# Altium schematic sheet Switches.SchDoc: Shaheen PCB Board
size A3; Author: Mattia Sinigaglia; CompanyName: University of Bologna; DrawnBy: Mattia Sinigaglia; Organization: EES - Micrel Lab; Revision: v1; SheetNumber: 5; SheetTotal: 6
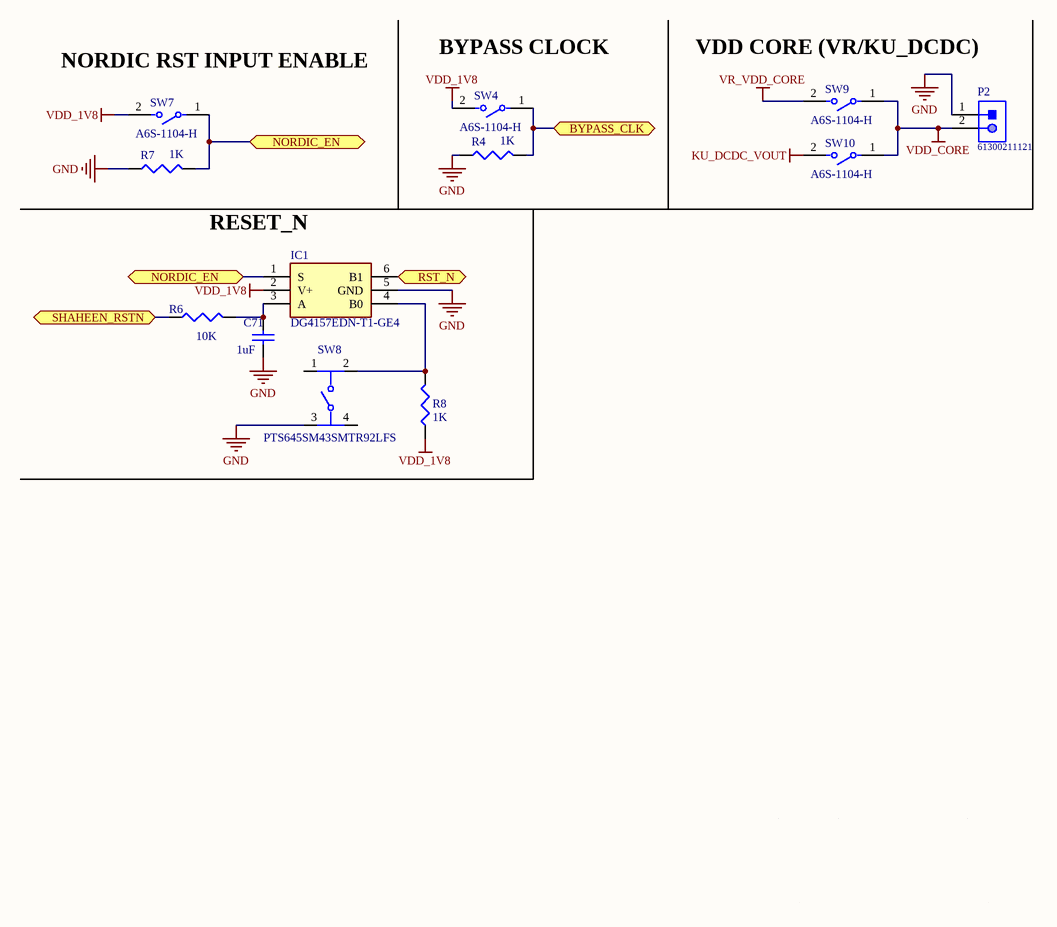
[diagram p0: Switches.SchDoc]

## Parts
C71  value 1uF  [0603]  (hidden comment: Cap)
IC1  DG4157EDN-T1-GE4  [SON35P100X100X38-6N]
P2  61300211121  [61300211121]
R4  value 1K  [J1-0603]  (hidden comment: 0R)
R6  value 10K  [J1-0603]  (hidden comment: 0R)
R7  value 1K  [J1-0603]  (hidden comment: 0R)
R8  value 1K  [J1-0603]  (hidden comment: 0R)
SW4  A6S-1104-H  [FP-A6S-1104-H-MFG]
SW7  A6S-1104-H  [FP-A6S-1104-H-MFG]
SW8  PTS645SM43SMTR92LFS  [FP-PTS645SM43SMTR92LFS-MFG]
SW9  A6S-1104-H  [FP-A6S-1104-H-MFG]
SW10  A6S-1104-H  [FP-A6S-1104-H-MFG]

## Ports
BYPASS_CLK (bidir), NORDIC_EN (bidir), RST_N (bidir), SHAHEEN_RSTN (bidir)

## Nets
GND: C71.2 IC1.5(GND) P2.1 R4.2 R7.2 SW8.3
KU_DCDC_VOUT: SW10.2
VDD_1V8: IC1.2(V+) R8.2 SW4.2 SW7.2
VDD_CORE: P2.2 SW9.1 SW10.1
VR_VDD_CORE: SW9.2
BYPASS_CLK: R4.1 SW4.1 ; port BYPASS_CLK
NORDIC_EN: IC1.1(S) R7.1 SW7.1 ; port NORDIC_EN
RST_N: IC1.6(B1) ; port RST_N
SHAHEEN_RSTN: R6.2 ; port SHAHEEN_RSTN
NetC71_1: C71.1 IC1.3(A) R6.1
NetIC1_4: IC1.4(B0) R8.1 SW8.2

Not connected (* = marked no-connect by the designer): SW8 1 4

## Notes on the sheet
- (near SW7) NORDIC RST INPUT ENABLE
- (near SW4) BYPASS CLOCK
- (near SW9) VDD CORE (VR/KU_DCDC)
- RESET_N
- 1
- 2
- 3
- 4
- 5
- 6
- 7
- 8
- A
- B
- C
- D
- Project:
- Date:
- Drawing number:
- Rev:
- Format:
- A3
- Drawn by:
- Laboratory:
- Page
- Sheet:
- of
- File:

## Library data of the parts
C71 = Cap: Capacitor; Published: 8-Jun-2000; LatestRevisionDate: 17-Jul-2002; LatestRevisionNote: Re-released for DXP Platform.; PackageReference: RAD-0.3; Publisher: Altium Limited; PackageDescription: Radial Cap, Thru-Hole; 2 Leads; 0.3 in Pin Spacing
IC1 = DG4157EDN-T1-GE4: Integrated Circuit; Manufacturer_Name: Vishay; Datasheet Link: https://componentsearchengine.com//DG4157EDN-T1-GE4.pdf; Height: 0.38mm; Mouser2 Part Number: 78-DG4157EDN-T1-GE4; Mouser2 Price/Stock: https://www.mouser.com/Search/Refine.aspx?Keyword=78-DG4157EDN-T1-GE4; Manufacturer_Part_Number: DG4157EDN-T1-GE4
P2 = CMP-1712-00002-4: THT Vertical Pin Header WR-PHD, Pitch 2.54 mm, Single Row, 2 pins; Manufacturer: Wurth Elektronik; Rated Current: 3A; Gender: Male; Withstanding Voltage: 500VAC; Working Voltage: 250VAC; Pitch: 2.54mm; Contact Resistance: 20mOhm; Pin Number: 2; Mounting Technology: THT; Orientation: Vertical; Operating Temperature: -40to105degC; Packaging: Bag; Publisher: WurthElektronik; Datasheet URL: https://katalog.we-online.de/em/datasheet/6130xx11121.pdf; Manufacturer URL: http://www.we-online.de; Row Number: Single; Package Reference: 61300211121; Part Number: 61300211121
R4 R6-R8 = Res3: Resistor; Published: 8-Jun-2000; LatestRevisionDate: 29-May-2009; LatestRevisionNote: IPC-7351 Footprint Added.; PackageReference: J1-0603; Publisher: Altium Limited; PackageDescription: Chip Resistor
SW4 SW7 SW9 SW10 = CMP-08827-000005-1: SWITCH SLIDE DIP SPST 25MA 24V; Manufacturer: Omron Electronics Inc-EMC Div; Throw Configuration: SPST-NO; Standoff Height: 0mm; Number Of Circuits: 1; Electromechanical Life: 1000Cycles; Contact Resistance: 200mΩ; Digikey Description: SWITCH SLIDE DIP SPST 25MA 24V; ComponentLink2Description: Datasheet; Mount: Surface Mount; Manufacturer Part Number: A6S-1104-H; ComponentLink2URL: https://omronfs.omron.com/en_US/ecb/products/pdf/en-a6s.pdf; Category: Switch; Height: 3.95mm; Device Class L3: DIP Switches; Octopart: https://octopart.com/a6s-1104-h-omron-55410938; Mouser Description: DIP Switches / SIP Switches Dip Switch; Lead Free: Yes; Temperature Range Low: -20°C; Temperature Range High: +70°C; Automotive: No; Ambient Temperature Range Low: -20°C; Ambient Temperature Range High: +70°C; Voltage Rating Dc: 24V; Device Class L2: Switches; RoHS: TRUE; Package: 0; Contact Current Rating: 25mA; Device Class L1: Electromechanical; Temperature: -20°C to +70°C
SW8 = CMP-2000-05160-2: SWITCH TACTILE SPST-NO 0.05A 12V; Contact Resistance: 100mR; Throw Configuration: SPST; Illumination Type: Non-Illuminated; Mechanical Life: 100000Cycles; Current Rating: 50mA; Switch Function: Off-Mom; Actuator Length: 0.85mm; Actuator Material: Nylon; Actuator Type: Standard; Operating Force: 160gf; Min Operating Temperature: -20°C; REACH SVHC: No SVHC; Termination: Gull Wing; Case/Package: SMD/SMT; Packaging: Tape and Reel; Mount: Surface Mount; Voltage Rating (DC): 12V; Orientation: Straight; Lead Free: Lead Free; Contact Material: Silver; Color: Black; Max Current Rating: 50mA; Contact Plating: Silver; Depth: 9mm; Package Quantity: 1; Max Voltage Rating (DC): 12V; Length: 6mm; Max Operating Temperature: 60°C